# EAGLE board 26-de-8x (EAGLE 6.6.0), part 1 of 3
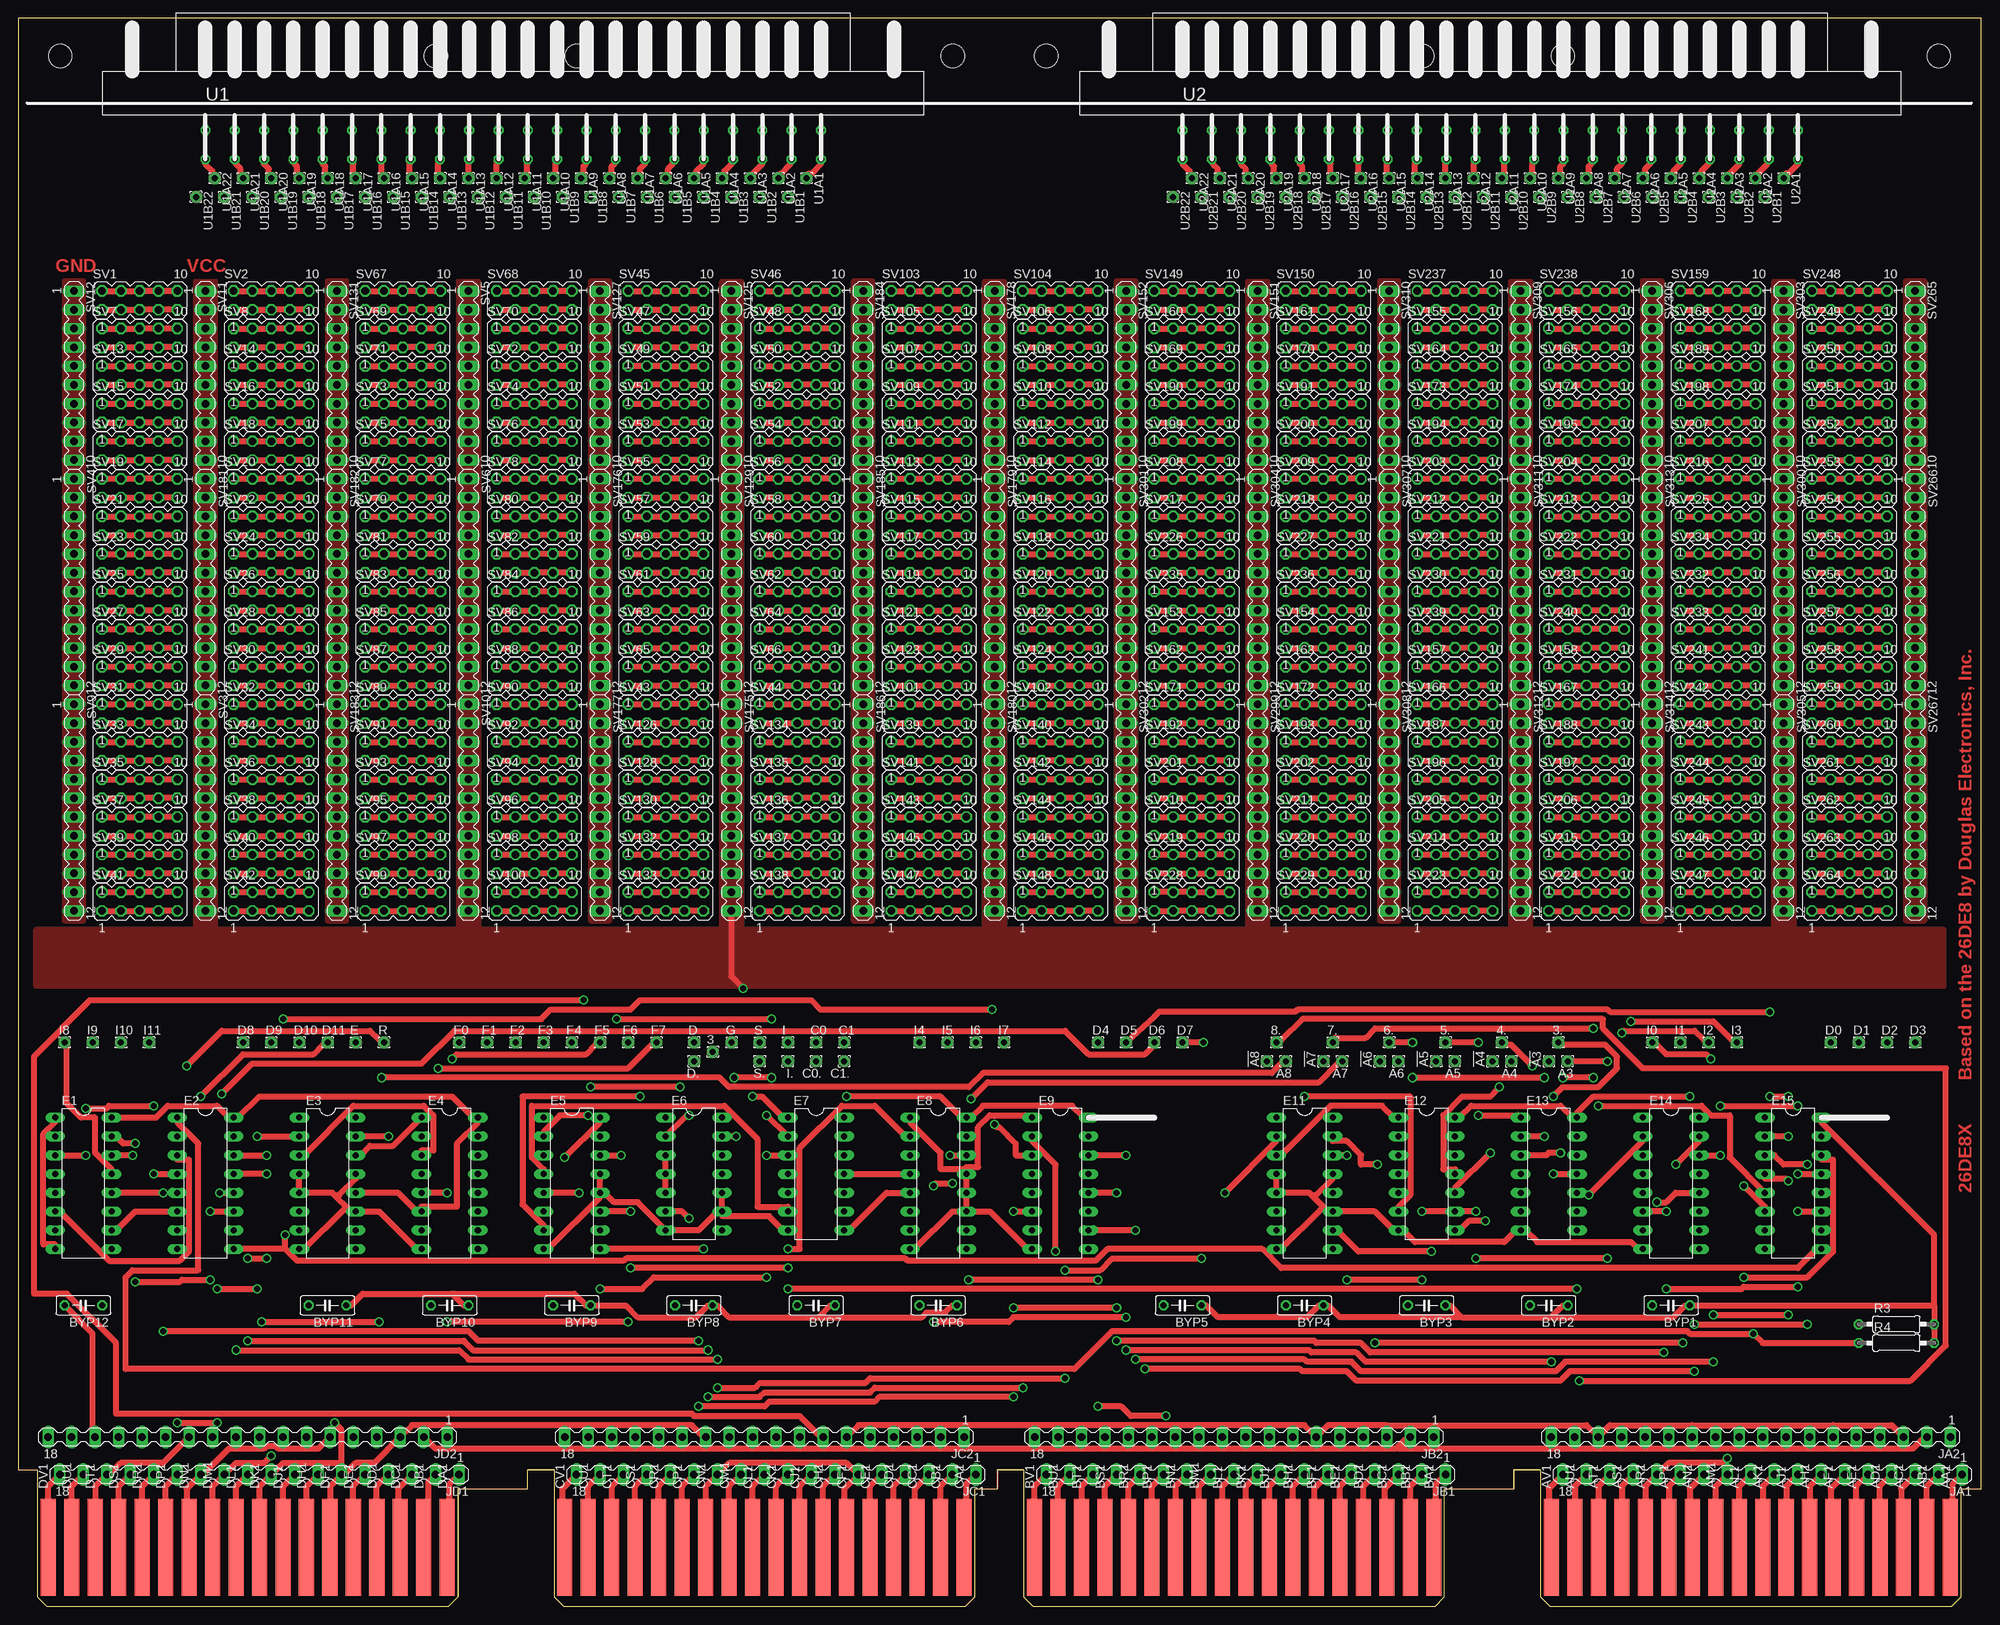
[diagram p4: board, top side]
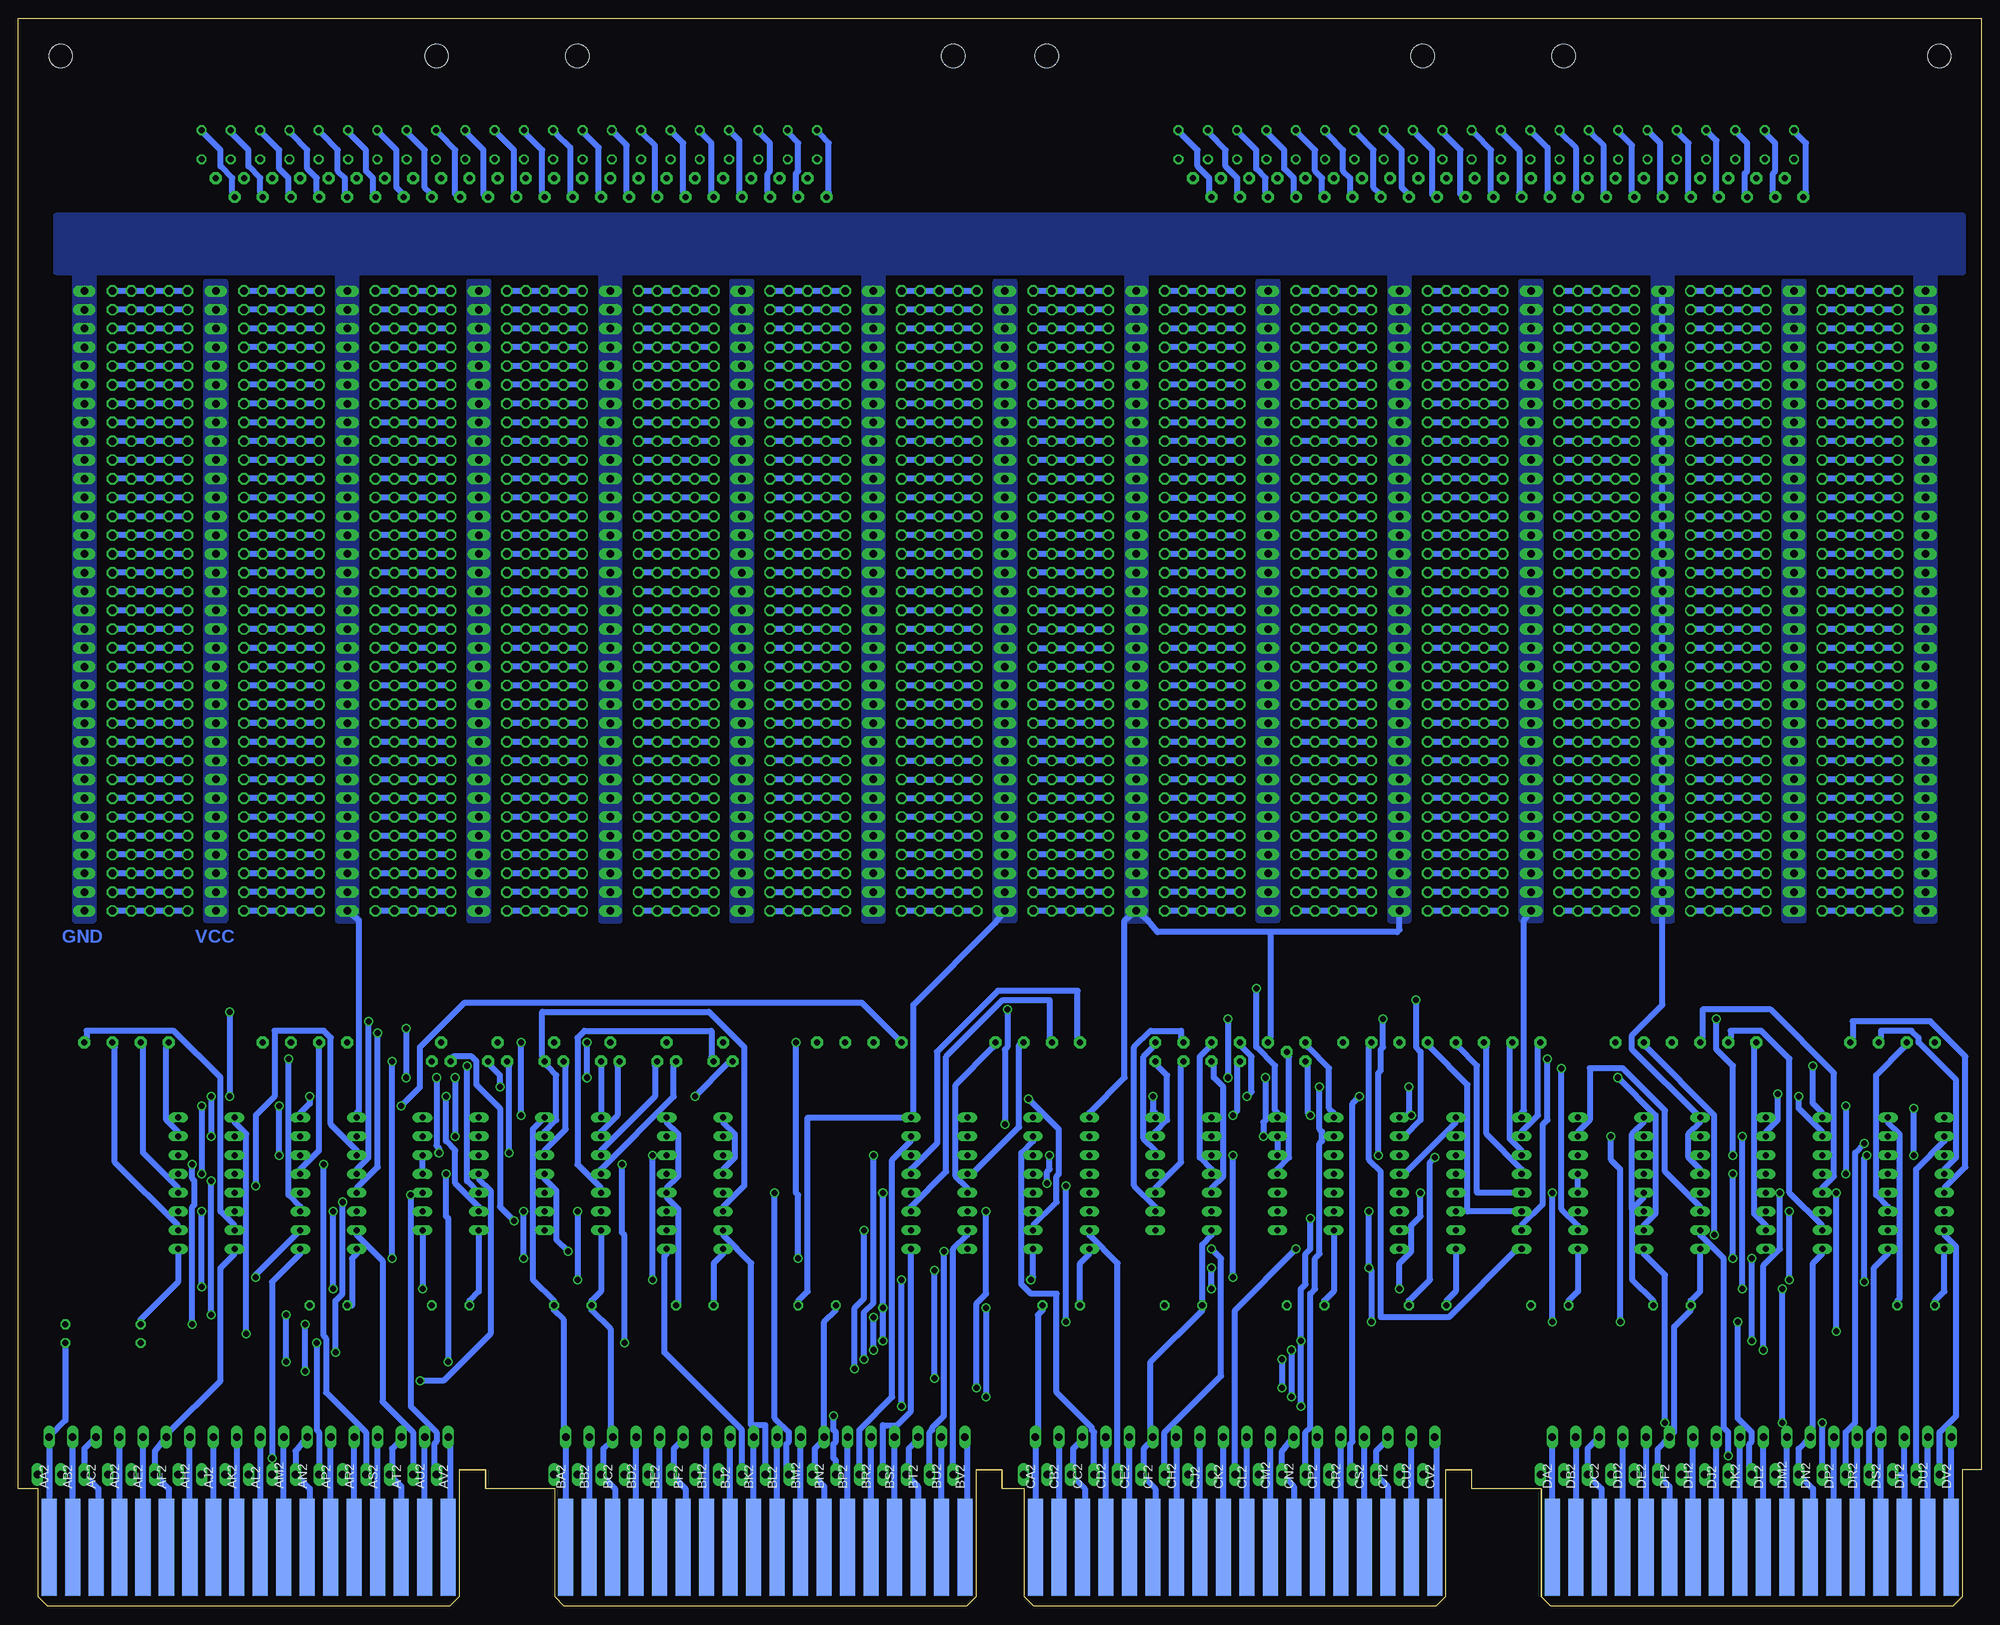
[diagram p5: board, bottom side, seen from below]

Size 265.3 x 214.63 mm. Coordinates in mm from the lower left corner, seen from the top.
Copper layers (1+16): Top 0.035mm / dielectric 1.5mm / Bottom 0.035mm
Design rules "16mils": minimum track width 16mil, minimum drill 32mil, track to track 15mil, track to pad 10mil, pad to pad 10mil, via to via 10mil, smd to smd 10mil, copper to edge 13mil, drill to drill 10mil, minimum pad ring 10mil, minimum via ring 8mil, stop-mask expansion 0mil, vias tented up to drill 0mil, thermal gap 10mil
Net classes: 0 default: width 0.813 mm; 1 supply: width 0.813 mm

## Footprints (pad centres in the part's own frame; a part is rotated, then mirrored left to right if it is on the bottom)
1,6/0,8 = drill 0.813 pad 1.6 octagon: 1 0,0
C050-025X075 = drill 0.813 octagon: 1 -2.54,0; 2 2.54,0
DIL16 = drill 0.813 long: 1 -8.89,-3.81; 2 -6.35,-3.81; 3 -3.81,-3.81; 4 -1.27,-3.81; 5 1.27,-3.81; 6 3.81,-3.81; 7 6.35,-3.81; 8 8.89,-3.81; 9 8.89,3.81; 10 6.35,3.81; 11 3.81,3.81; 12 1.27,3.81; 13 -1.27,3.81; 14 -3.81,3.81; 15 -6.35,3.81; 16 -8.89,3.81
DIL14 = drill 0.813 long: 1 -7.62,-3.81; 2 -5.08,-3.81; 3 -2.54,-3.81; 4 0,-3.81; 5 2.54,-3.81; 6 5.08,-3.81; 7 7.62,-3.81; 8 7.62,3.81; 9 5.08,3.81; 10 2.54,3.81; 11 0,3.81; 12 -2.54,3.81; 13 -5.08,3.81; 14 -7.62,3.81
MA18-1 = drill 1.016 long: 1 -25.4,0; 2 -22.225,0; 3 -19.05,0; 4 -15.875,0; 5 -12.7,0; 6 -9.525,0; 7 -6.35,0; 8 -3.175,0; 9 0,0; 10 3.175,0; 11 6.35,0; 12 9.525,0; 13 12.7,0; 14 15.875,0; 15 19.05,0; 16 22.225,0; 17 25.4,0; 18 28.575,0
0207/10 = drill 0.813 octagon: 1 -5.08,0; 2 5.08,0
MA05-2 = drill 1.016 octagon: 1 -5.08,-1.27; 2 -5.08,1.27; 3 -2.54,-1.27; 4 -2.54,1.27; 5 0,-1.27; 6 0,1.27; 7 2.54,-1.27; 8 2.54,1.27; 9 5.08,-1.27; 10 5.08,1.27
MA12-1 = drill 1.016 long: 1 -13.97,0; 2 -11.43,0; 3 -8.89,0; 4 -6.35,0; 5 -3.81,0; 6 -1.27,0; 7 1.27,0; 8 3.81,0; 9 6.35,0; 10 8.89,0; 11 11.43,0; 12 13.97,0
MA10-1 = drill 1.016 long: 1 -11.43,0; 2 -8.89,0; 3 -6.35,0; 4 -3.81,0; 5 -1.27,0; 6 1.27,0; 7 3.81,0; 8 6.35,0; 9 8.89,0; 10 11.43,0
133-022-03 = drill 0.813 octagon: A1 83.21,0; A2 83.21,3.962; B1 79.248,0; B2 79.248,3.962; C1 75.286,0; C2 75.286,3.962; D1 71.323,0; D2 71.323,3.962; E1 67.361,0; E2 67.361,3.962; F1 63.398,0; F2 63.398,3.962; H1 59.436,0; H2 59.436,3.962; J1 55.474,0; J2 55.474,3.962; K1 51.511,0; K2 51.511,3.962; L1 47.549,0; L2 47.549,3.962; M1 43.586,0; M2 43.586,3.962; N1 39.624,0; N2 39.624,3.962; P1 35.662,0; P2 35.662,3.962; R1 31.699,0; R2 31.699,3.962; S1 27.737,0; S2 27.737,3.962; T1 23.774,0; T2 23.774,3.962; U1 19.812,0; U2 19.812,3.962; V1 15.85,0; V2 15.85,3.962; W1 11.887,0; W2 11.887,3.962; X1 7.925,0; X2 7.925,3.962; Y1 3.962,0; Y2 3.962,3.962; Z1 0,0; Z2 0,3.962
OMNIBUS = hole 3.175: 208.915,209.55; 259.715,209.55; 189.865,209.55; 139.065,209.55; 75.616,209.55; 126.416,209.55; 56.566,209.55; 5.766,209.55
EDGE-CON8 = smd 2.032 x 13.106: AA1 261.303,7.938; AB1 258.127,7.938; AC1 254.952,7.938; AD1 251.778,7.938; AE1 248.602,7.938; AF1 245.428,7.938; AH1 242.252,7.938; AJ1 239.077,7.938; AK1 235.903,7.938; AL1 232.727,7.938; AM1 229.553,7.938; AN1 226.377,7.938; AP1 223.202,7.938; AR1 220.028,7.938; AS1 216.852,7.938; AT1 213.678,7.938; AU1 210.502,7.938; AV1 207.327,7.938; BA1 191.452,7.938; BB1 188.278,7.938; BC1 185.102,7.938; BD1 181.928,7.938; BE1 178.752,7.938; BF1 175.577,7.938; BH1 172.403,7.938; BJ1 169.227,7.938; BK1 166.053,7.938; BL1 162.877,7.938; BM1 159.702,7.938; BN1 156.528,7.938; BP1 153.352,7.938; BR1 150.178,7.938; BS1 147.002,7.938; BT1 143.827,7.938; BU1 140.653,7.938; BV1 137.477,7.938; CA1 127.953,7.938; CB1 124.778,7.938; CC1 121.603,7.938; CD1 118.427,7.938; CE1 115.252,7.938; CF1 112.078,7.938; CH1 108.903,7.938; CJ1 105.728,7.938; CK1 102.552,7.938; CL1 99.377,7.938; CM1 96.203,7.938; CN1 93.028,7.938; CP1 89.853,7.938; CR1 86.677,7.938; CS1 83.502,7.938; CT1 80.328,7.938; CU1 77.153,7.938; CV1 73.978,7.938; DA1 58.102,7.938; DB1 54.928,7.938; DC1 51.752,7.938; DD1 48.578,7.938; DE1 45.403,7.938; DF1 42.227,7.938; DH1 39.053,7.938; DJ1 35.877,7.938; DK1 32.703,7.938; DL1 29.527,7.938; DM1 26.352,7.938; DN1 23.177,7.938; DP1 20.003,7.938; DR1 16.828,7.938; DS1 13.652,7.938; DT1 10.477,7.938; DU1 7.303,7.938; DV1 4.128,7.938 | smd 2.032 x 13.106 bottom: AA2 261.303,7.938; AB2 258.127,7.938; AC2 254.952,7.938; AD2 251.778,7.938; AE2 248.602,7.938; AF2 245.428,7.938; AH2 242.252,7.938; AJ2 239.077,7.938; AK2 235.903,7.938; AL2 232.727,7.938; AM2 229.553,7.938; AN2 226.377,7.938; AP2 223.202,7.938; AR2 220.028,7.938; AS2 216.852,7.938; AT2 213.678,7.938; AU2 210.502,7.938; AV2 207.327,7.938; BA2 191.452,7.938; BB2 188.278,7.938; BC2 185.102,7.938; BD2 181.928,7.938; BE2 178.752,7.938; BF2 175.577,7.938; BH2 172.403,7.938; BJ2 169.227,7.938; BK2 166.053,7.938; BL2 162.877,7.938; BM2 159.702,7.938; BN2 156.528,7.938; BP2 153.352,7.938; BR2 150.178,7.938; BS2 147.002,7.938; BT2 143.827,7.938; BU2 140.653,7.938; BV2 137.477,7.938; CA2 127.953,7.938; CB2 124.778,7.938; CC2 121.603,7.938; CD2 118.427,7.938; CE2 115.252,7.938; CF2 112.078,7.938; CH2 108.903,7.938; CJ2 105.728,7.938; CK2 102.552,7.938; CL2 99.377,7.938; CM2 96.203,7.938; CN2 93.028,7.938; CP2 89.853,7.938; CR2 86.677,7.938; CS2 83.502,7.938; CT2 80.328,7.938; CU2 77.153,7.938; CV2 73.978,7.938; DA2 58.102,7.938; DB2 54.928,7.938; DC2 51.752,7.938; DD2 48.578,7.938; DE2 45.403,7.938; DF2 42.227,7.938; DH2 39.053,7.938; DJ2 35.877,7.938; DK2 32.703,7.938; DL2 29.527,7.938; DM2 26.352,7.938; DN2 23.177,7.938; DP2 20.003,7.938; DR2 16.828,7.938; DS2 13.652,7.938; DT2 10.477,7.938; DU2 7.303,7.938; DV2 4.128,7.938

## Placement (x,y rotation side)
3  [1,6/0,8]  93.85,74.93 0 top
3.  [1,6/0,8]  208.15,76.2 0 top
4.  [1,6/0,8]  200.53,76.2 0 top
5.  [1,6/0,8]  192.91,76.2 0 top
6.  [1,6/0,8]  185.29,76.2 0 top
7.  [1,6/0,8]  177.67,76.2 0 top
8.  [1,6/0,8]  170.05,76.2 0 top
!A3  [1,6/0,8]  206.88,73.66 90 top
!A4  [1,6/0,8]  199.26,73.66 90 top
!A5  [1,6/0,8]  191.64,73.66 90 top
!A6  [1,6/0,8]  184.02,73.66 90 top
!A7  [1,6/0,8]  176.4,73.66 90 top
!A8  [1,6/0,8]  168.78,73.66 90 top
A3  [1,6/0,8]  209.42,73.66 180 top
A4  [1,6/0,8]  201.8,73.66 180 top
A5  [1,6/0,8]  194.18,73.66 180 top
A6  [1,6/0,8]  186.56,73.66 180 top
A7  [1,6/0,8]  178.94,73.66 180 top
A8  [1,6/0,8]  171.32,73.66 180 top
BYP1  0.1uF  [C050-025X075]  223.39,40.64 180 top
BYP2  0.1uF  [C050-025X075]  206.88,40.64 180 top
BYP3  0.1uF  [C050-025X075]  190.37,40.64 180 top
BYP4  0.1uF  [C050-025X075]  173.86,40.64 180 top
BYP5  0.1uF  [C050-025X075]  157.35,40.64 180 top
BYP6  0.1uF  [C050-025X075]  124.33,40.64 180 top
BYP7  0.1uF  [C050-025X075]  107.82,40.64 180 top
BYP8  0.1uF  [C050-025X075]  91.31,40.64 180 top
BYP9  0.1uF  [C050-025X075]  74.8,40.64 180 top
BYP10  0.1uF  [C050-025X075]  58.29,40.64 180 top
BYP11  0.1uF  [C050-025X075]  41.78,40.64 180 top
BYP12  0.1uF  [C050-025X075]  8.76,40.64 180 top
C0  [1,6/0,8]  107.82,76.2 0 top
C0.  [1,6/0,8]  107.82,73.66 180 top
C1  [1,6/0,8]  111.63,76.2 0 top
C1.  [1,6/0,8]  111.63,73.66 180 top
D  [1,6/0,8]  91.31,76.2 0 top
D0  [1,6/0,8]  244.98,76.2 0 top
D1  [1,6/0,8]  248.79,76.2 0 top
D2  [1,6/0,8]  252.6,76.2 0 top
D3  [1,6/0,8]  256.41,76.2 0 top
D4  [1,6/0,8]  145.92,76.2 0 top
D5  [1,6/0,8]  149.73,76.2 0 top
D6  [1,6/0,8]  153.54,76.2 0 top
D7  [1,6/0,8]  157.35,76.2 0 top
D8  [1,6/0,8]  30.35,76.2 0 top
D9  [1,6/0,8]  34.16,76.2 0 top
D10  [1,6/0,8]  37.97,76.2 0 top
D11  [1,6/0,8]  41.78,76.2 0 top
D.  [1,6/0,8]  91.31,73.66 180 top
E  [1,6/0,8]  45.59,76.2 0 top
E1  AM26S10  [DIL16]  8.76,57.15 270 top
E2  74174N  [DIL16]  25.27,57.15 270 top
E3  AM26S10  [DIL16]  41.78,57.15 270 top
E4  74S138N  [DIL16]  58.29,57.15 270 top
E5  AM26S10  [DIL16]  74.8,57.15 270 top
E6  74LS00N  [DIL14]  91.31,58.42 270 top
E7  74LS08N  [DIL14]  107.82,58.42 270 top
E8  AM26S10  [DIL16]  124.33,57.15 270 top
E9  AM26S10  [DIL16]  140.84,57.15 270 top
E11  AM26S10  [DIL16]  173.86,57.15 270 top
E12  74LS04N  [DIL14]  190.37,58.42 270 top
E13  7430N  [DIL14]  206.88,58.42 270 top
E14  AM26S10  [DIL16]  223.39,57.15 270 top
E15  74174N  [DIL16]  239.9,57.15 270 top
F0  [1,6/0,8]  59.56,76.2 0 top
F1  [1,6/0,8]  63.37,76.2 0 top
F2  [1,6/0,8]  67.18,76.2 0 top
F3  [1,6/0,8]  70.99,76.2 0 top
F4  [1,6/0,8]  74.8,76.2 0 top
F5  [1,6/0,8]  78.61,76.2 0 top
F6  [1,6/0,8]  82.42,76.2 0 top
F7  [1,6/0,8]  86.23,76.2 0 top
G  [1,6/0,8]  96.39,76.2 0 top
I  [1,6/0,8]  104.01,76.2 0 top
I0  [1,6/0,8]  220.85,76.2 0 top
I1  [1,6/0,8]  224.66,76.2 0 top
I2  [1,6/0,8]  228.47,76.2 0 top
I3  [1,6/0,8]  232.28,76.2 0 top
I4  [1,6/0,8]  121.79,76.2 0 top
I5  [1,6/0,8]  125.6,76.2 0 top
I6  [1,6/0,8]  129.41,76.2 0 top
I7  [1,6/0,8]  133.22,76.2 0 top
I8  [1,6/0,8]  6.22,76.2 0 top
I9  [1,6/0,8]  10.03,76.2 0 top
I10  [1,6/0,8]  13.84,76.2 0 top
I11  [1,6/0,8]  17.65,76.2 0 top
I.  [1,6/0,8]  104.01,73.66 180 top
JA1  MA18-1  [MA18-1]  237.36,17.78 180 top
JA2  MA18-1  [MA18-1]  235.78,22.86 180 top
JB1  MA18-1  [MA18-1]  167.51,17.78 180 top
JB2  MA18-1  [MA18-1]  165.93,22.86 180 top
JC1  MA18-1  [MA18-1]  104.01,17.78 180 top
JC2  MA18-1  [MA18-1]  102.43,22.86 180 top
JD1  MA18-1  [MA18-1]  34.16,17.78 180 top
JD2  MA18-1  [MA18-1]  32.58,22.86 180 top
R  [1,6/0,8]  49.4,76.2 0 top
R3  [0207/10]  253.87,38.1 0 top
R4  [0207/10]  253.87,35.56 0 top
S  [1,6/0,8]  100.2,76.2 0 top
S.  [1,6/0,8]  100.2,73.66 180 top
SV1  [MA05-2]  16.38,176.53 0 top
SV2  [MA05-2]  34.16,176.53 0 top
SV3  [MA12-1]  25.27,107.95 270 top
SV4  [MA12-1]  7.49,138.43 270 top
SV5  [MA10-1]  60.83,166.37 270 top
SV6  [MA12-1]  60.83,138.43 270 top
SV7  [MA05-2]  16.38,171.45 0 top
SV8  [MA05-2]  34.16,171.45 0 top
SV9  [MA12-1]  7.49,107.95 270 top
SV10  [MA12-1]  60.83,107.95 270 top
SV11  [MA10-1]  25.27,166.37 270 top
SV12  [MA10-1]  7.49,166.37 270 top
SV13  [MA05-2]  16.38,166.37 0 top
SV14  [MA05-2]  34.16,166.37 0 top
SV15  [MA05-2]  16.38,161.29 0 top
SV16  [MA05-2]  34.16,161.29 0 top
SV17  [MA05-2]  16.38,156.21 0 top
SV18  [MA05-2]  34.16,156.21 0 top
SV19  [MA05-2]  16.38,151.13 0 top
SV20  [MA05-2]  34.16,151.13 0 top
SV21  [MA05-2]  16.38,146.05 0 top
SV22  [MA05-2]  34.16,146.05 0 top
SV23  [MA05-2]  16.38,140.97 0 top
SV24  [MA05-2]  34.16,140.97 0 top
SV25  [MA05-2]  16.38,135.89 0 top
SV26  [MA05-2]  34.16,135.89 0 top
SV27  [MA05-2]  16.38,130.81 0 top
SV28  [MA05-2]  34.16,130.81 0 top
SV29  [MA05-2]  16.38,125.73 0 top
SV30  [MA05-2]  34.16,125.73 0 top
SV31  [MA05-2]  16.38,120.65 0 top
SV32  [MA05-2]  34.16,120.65 0 top
SV33  [MA05-2]  16.38,115.57 0 top
SV34  [MA05-2]  34.16,115.57 0 top
SV35  [MA05-2]  16.38,110.49 0 top
SV36  [MA05-2]  34.16,110.49 0 top
SV37  [MA05-2]  16.38,105.41 0 top
SV38  [MA05-2]  34.16,105.41 0 top
SV39  [MA05-2]  16.38,100.33 0 top
SV40  [MA05-2]  34.16,100.33 0 top
SV41  [MA05-2]  16.38,95.25 0 top
SV42  [MA05-2]  34.16,95.25 0 top
SV43  [MA05-2]  87.5,120.65 0 top
SV44  [MA05-2]  105.28,120.65 0 top
SV45  [MA05-2]  87.5,176.53 0 top
SV46  [MA05-2]  105.28,176.53 0 top
SV47  [MA05-2]  87.5,171.45 0 top
SV48  [MA05-2]  105.28,171.45 0 top
SV49  [MA05-2]  87.5,166.37 0 top
SV50  [MA05-2]  105.28,166.37 0 top
SV51  [MA05-2]  87.5,161.29 0 top
SV52  [MA05-2]  105.28,161.29 0 top
SV53  [MA05-2]  87.5,156.21 0 top
SV54  [MA05-2]  105.28,156.21 0 top
SV55  [MA05-2]  87.5,151.13 0 top
SV56  [MA05-2]  105.28,151.13 0 top
SV57  [MA05-2]  87.5,146.05 0 top
SV58  [MA05-2]  105.28,146.05 0 top
SV59  [MA05-2]  87.5,140.97 0 top
SV60  [MA05-2]  105.28,140.97 0 top
SV61  [MA05-2]  87.5,135.89 0 top
SV62  [MA05-2]  105.28,135.89 0 top
SV63  [MA05-2]  87.5,130.81 0 top
SV64  [MA05-2]  105.28,130.81 0 top
SV65  [MA05-2]  87.5,125.73 0 top
SV66  [MA05-2]  105.28,125.73 0 top
SV67  [MA05-2]  51.94,176.53 0 top
SV68  [MA05-2]  69.72,176.53 0 top
SV69  [MA05-2]  51.94,171.45 0 top
SV70  [MA05-2]  69.72,171.45 0 top
SV71  [MA05-2]  51.94,166.37 0 top
SV72  [MA05-2]  69.72,166.37 0 top
SV73  [MA05-2]  51.94,161.29 0 top
SV74  [MA05-2]  69.72,161.29 0 top
SV75  [MA05-2]  51.94,156.21 0 top
SV76  [MA05-2]  69.72,156.21 0 top
SV77  [MA05-2]  51.94,151.13 0 top
SV78  [MA05-2]  69.72,151.13 0 top
SV79  [MA05-2]  51.94,146.05 0 top
SV80  [MA05-2]  69.72,146.05 0 top
SV81  [MA05-2]  51.94,140.97 0 top
SV82  [MA05-2]  69.72,140.97 0 top
SV83  [MA05-2]  51.94,135.89 0 top
SV84  [MA05-2]  69.72,135.89 0 top
SV85  [MA05-2]  51.94,130.81 0 top
SV86  [MA05-2]  69.72,130.81 0 top
SV87  [MA05-2]  51.94,125.73 0 top
SV88  [MA05-2]  69.72,125.73 0 top
SV89  [MA05-2]  51.94,120.65 0 top
SV90  [MA05-2]  69.72,120.65 0 top
SV91  [MA05-2]  51.94,115.57 0 top
SV92  [MA05-2]  69.72,115.57 0 top
SV93  [MA05-2]  51.94,110.49 0 top
SV94  [MA05-2]  69.72,110.49 0 top
SV95  [MA05-2]  51.94,105.41 0 top
SV96  [MA05-2]  69.72,105.41 0 top
SV97  [MA05-2]  51.94,100.33 0 top
SV98  [MA05-2]  69.72,100.33 0 top
SV99  [MA05-2]  51.94,95.25 0 top
SV100  [MA05-2]  69.72,95.25 0 top
SV101  [MA05-2]  123.06,120.65 0 top
SV102  [MA05-2]  140.84,120.65 0 top
SV103  [MA05-2]  123.06,176.53 0 top
SV104  [MA05-2]  140.84,176.53 0 top
SV105  [MA05-2]  123.06,171.45 0 top
SV106  [MA05-2]  140.84,171.45 0 top
SV107  [MA05-2]  123.06,166.37 0 top
SV108  [MA05-2]  140.84,166.37 0 top
SV109  [MA05-2]  123.06,161.29 0 top
SV110  [MA05-2]  140.84,161.29 0 top
SV111  [MA05-2]  123.06,156.21 0 top
SV112  [MA05-2]  140.84,156.21 0 top
SV113  [MA05-2]  123.06,151.13 0 top
SV114  [MA05-2]  140.84,151.13 0 top
SV115  [MA05-2]  123.06,146.05 0 top
SV116  [MA05-2]  140.84,146.05 0 top
SV117  [MA05-2]  123.06,140.97 0 top
SV118  [MA05-2]  140.84,140.97 0 top
SV119  [MA05-2]  123.06,135.89 0 top
SV120  [MA05-2]  140.84,135.89 0 top
SV121  [MA05-2]  123.06,130.81 0 top
SV122  [MA05-2]  140.84,130.81 0 top
SV123  [MA05-2]  123.06,125.73 0 top
SV124  [MA05-2]  140.84,125.73 0 top
SV125  [MA10-1]  96.39,166.37 270 top
SV126  [MA05-2]  87.5,115.57 0 top
SV127  [MA10-1]  78.61,166.37 270 top
SV128  [MA05-2]  87.5,110.49 0 top
SV129  [MA12-1]  96.39,138.43 270 top
SV130  [MA05-2]  87.5,105.41 0 top
SV131  [MA10-1]  43.05,166.37 270 top
SV132  [MA05-2]  87.5,100.33 0 top
SV133  [MA05-2]  87.5,95.25 0 top
SV134  [MA05-2]  105.28,115.57 0 top
SV135  [MA05-2]  105.28,110.49 0 top
SV136  [MA05-2]  105.28,105.41 0 top
SV137  [MA05-2]  105.28,100.33 0 top
SV138  [MA05-2]  105.28,95.25 0 top
SV139  [MA05-2]  123.06,115.57 0 top
SV140  [MA05-2]  140.84,115.57 0 top
SV141  [MA05-2]  123.06,110.49 0 top
SV142  [MA05-2]  140.84,110.49 0 top
SV143  [MA05-2]  123.06,105.41 0 top
SV144  [MA05-2]  140.84,105.41 0 top
SV145  [MA05-2]  123.06,100.33 0 top
SV146  [MA05-2]  140.84,100.33 0 top
SV147  [MA05-2]  123.06,95.25 0 top
SV148  [MA05-2]  140.84,95.25 0 top
SV149  [MA05-2]  158.62,176.53 0 top
SV150  [MA05-2]  176.4,176.53 0 top
SV151  [MA10-1]  167.51,166.37 270 top
SV152  [MA10-1]  149.73,166.37 270 top
SV153  [MA05-2]  158.62,130.81 0 top
SV154  [MA05-2]  176.4,130.81 0 top
SV155  [MA05-2]  194.18,171.45 0 top
SV156  [MA05-2]  211.96,171.45 0 top
SV157  [MA05-2]  194.18,125.73 0 top
SV158  [MA05-2]  211.96,125.73 0 top
SV159  [MA05-2]  229.74,176.53 0 top
SV160  [MA05-2]  158.62,171.45 0 top
SV161  [MA05-2]  176.4,171.45 0 top
SV162  [MA05-2]  158.62,125.73 0 top
SV163  [MA05-2]  176.4,125.73 0 top
SV164  [MA05-2]  194.18,166.37 0 top
SV165  [MA05-2]  211.96,166.37 0 top
SV166  [MA05-2]  194.18,120.65 0 top
SV167  [MA05-2]  211.96,120.65 0 top
SV168  [MA05-2]  229.74,171.45 0 top
SV169  [MA05-2]  158.62,166.37 0 top
SV170  [MA05-2]  176.4,166.37 0 top
SV171  [MA05-2]  158.62,120.65 0 top
SV172  [MA05-2]  176.4,120.65 0 top
SV173  [MA05-2]  194.18,161.29 0 top
SV174  [MA05-2]  211.96,161.29 0 top
SV175  [MA12-1]  96.39,107.95 270 top
SV176  [MA12-1]  78.61,138.43 270 top
SV177  [MA12-1]  78.61,107.95 270 top
SV178  [MA10-1]  131.95,166.37 270 top
SV179  [MA12-1]  131.95,138.43 270 top
SV180  [MA12-1]  131.95,107.95 270 top
SV181  [MA12-1]  25.27,138.43 270 top
SV182  [MA12-1]  43.05,138.43 270 top
SV183  [MA12-1]  43.05,107.95 270 top
SV184  [MA10-1]  114.17,166.37 270 top
SV185  [MA12-1]  114.17,138.43 270 top
SV186  [MA12-1]  114.17,107.95 270 top
SV187  [MA05-2]  194.18,115.57 0 top
SV188  [MA05-2]  211.96,115.57 0 top
SV189  [MA05-2]  229.74,166.37 0 top
SV190  [MA05-2]  158.62,161.29 0 top
SV191  [MA05-2]  176.4,161.29 0 top
SV192  [MA05-2]  158.62,115.57 0 top
SV193  [MA05-2]  176.4,115.57 0 top
SV194  [MA05-2]  194.18,156.21 0 top
SV195  [MA05-2]  211.96,156.21 0 top
SV196  [MA05-2]  194.18,110.49 0 top
SV197  [MA05-2]  211.96,110.49 0 top
SV198  [MA05-2]  229.74,161.29 0 top
SV199  [MA05-2]  158.62,156.21 0 top
SV200  [MA05-2]  176.4,156.21 0 top
SV201  [MA05-2]  158.62,110.49 0 top
SV202  [MA05-2]  176.4,110.49 0 top
SV203  [MA05-2]  194.18,151.13 0 top
SV204  [MA05-2]  211.96,151.13 0 top
SV205  [MA05-2]  194.18,105.41 0 top
SV206  [MA05-2]  211.96,105.41 0 top
SV207  [MA05-2]  229.74,156.21 0 top
SV208  [MA05-2]  158.62,151.13 0 top
SV209  [MA05-2]  176.4,151.13 0 top
SV210  [MA05-2]  158.62,105.41 0 top
SV211  [MA05-2]  176.4,105.41 0 top
SV212  [MA05-2]  194.18,146.05 0 top
SV213  [MA05-2]  211.96,146.05 0 top
SV214  [MA05-2]  194.18,100.33 0 top
SV215  [MA05-2]  211.96,100.33 0 top
SV216  [MA05-2]  229.74,151.13 0 top
SV217  [MA05-2]  158.62,146.05 0 top
SV218  [MA05-2]  176.4,146.05 0 top
SV219  [MA05-2]  158.62,100.33 0 top
SV220  [MA05-2]  176.4,100.33 0 top
SV221  [MA05-2]  194.18,140.97 0 top
SV222  [MA05-2]  211.96,140.97 0 top
SV223  [MA05-2]  194.18,95.25 0 top
SV224  [MA05-2]  211.96,95.25 0 top
SV225  [MA05-2]  229.74,146.05 0 top
SV226  [MA05-2]  158.62,140.97 0 top
SV227  [MA05-2]  176.4,140.97 0 top
SV228  [MA05-2]  158.62,95.25 0 top
SV229  [MA05-2]  176.4,95.25 0 top
SV230  [MA05-2]  194.18,135.89 0 top
SV231  [MA05-2]  211.96,135.89 0 top
SV232  [MA05-2]  229.74,135.89 0 top
SV233  [MA05-2]  229.74,130.81 0 top
SV234  [MA05-2]  229.74,140.97 0 top
SV235  [MA05-2]  158.62,135.89 0 top
SV236  [MA05-2]  176.4,135.89 0 top
SV237  [MA05-2]  194.18,176.53 0 top
SV238  [MA05-2]  211.96,176.53 0 top
SV239  [MA05-2]  194.18,130.81 0 top
SV240  [MA05-2]  211.96,130.81 0 top
SV241  [MA05-2]  229.74,125.73 0 top
SV242  [MA05-2]  229.74,120.65 0 top
SV243  [MA05-2]  229.74,115.57 0 top
SV244  [MA05-2]  229.74,110.49 0 top
SV245  [MA05-2]  229.74,105.41 0 top
SV246  [MA05-2]  229.74,100.33 0 top
SV247  [MA05-2]  229.74,95.25 0 top
SV248  [MA05-2]  247.52,176.53 0 top
SV249  [MA05-2]  247.52,171.45 0 top
SV250  [MA05-2]  247.52,166.37 0 top
SV251  [MA05-2]  247.52,161.29 0 top
SV252  [MA05-2]  247.52,156.21 0 top
SV253  [MA05-2]  247.52,151.13 0 top
SV254  [MA05-2]  247.52,146.05 0 top
SV255  [MA05-2]  247.52,140.97 0 top
SV256  [MA05-2]  247.52,135.89 0 top
SV257  [MA05-2]  247.52,130.81 0 top
SV258  [MA05-2]  247.52,125.73 0 top
SV259  [MA05-2]  247.52,120.65 0 top
SV260  [MA05-2]  247.52,115.57 0 top
SV261  [MA05-2]  247.52,110.49 0 top
SV262  [MA05-2]  247.52,105.41 0 top
SV263  [MA05-2]  247.52,100.33 0 top
SV264  [MA05-2]  247.52,95.25 0 top
SV265  [MA10-1]  256.41,166.37 270 top
SV266  [MA12-1]  256.41,138.43 270 top
SV267  [MA12-1]  256.41,107.95 270 top
SV299  [MA12-1]  167.51,107.95 270 top
SV300  [MA12-1]  238.63,138.43 270 top
SV301  [MA12-1]  149.73,138.43 270 top
SV302  [MA12-1]  149.73,107.95 270 top
SV303  [MA10-1]  238.63,166.37 270 top
SV304  [MA12-1]  167.51,138.43 270 top
SV305  [MA12-1]  238.63,107.95 270 top
SV306  [MA10-1]  220.85,166.37 270 top
SV307  [MA12-1]  185.29,138.43 270 top
SV308  [MA12-1]  185.29,107.95 270 top
SV309  [MA10-1]  203.07,166.37 270 top
SV310  [MA10-1]  185.29,166.37 270 top
SV311  [MA12-1]  203.07,138.43 270 top
SV312  [MA12-1]  203.07,107.95 270 top
SV313  [MA12-1]  220.85,138.43 270 top
SV314  [MA12-1]  220.85,107.95 270 top
U1  133-022-03  [133-022-03]  25.27,195.58 0 top
U1A1  [1,6/0,8]  106.55,193.04 270 top
U1A2  [1,6/0,8]  102.74,193.04 270 top
U1A3  [1,6/0,8]  98.93,193.04 270 top
U1A4  [1,6/0,8]  95.12,193.04 270 top
U1A5  [1,6/0,8]  91.31,193.04 270 top
U1A6  [1,6/0,8]  87.5,193.04 270 top
U1A7  [1,6/0,8]  83.69,193.04 270 top
U1A8  [1,6/0,8]  79.88,193.04 270 top
U1A9  [1,6/0,8]  76.07,193.04 270 top
U1A10  [1,6/0,8]  72.26,193.04 270 top
U1A11  [1,6/0,8]  68.45,193.04 270 top
U1A12  [1,6/0,8]  64.64,193.04 270 top
U1A13  [1,6/0,8]  60.83,193.04 270 top
U1A14  [1,6/0,8]  57.02,193.04 270 top
U1A15  [1,6/0,8]  53.21,193.04 270 top
U1A16  [1,6/0,8]  49.4,193.04 270 top
U1A17  [1,6/0,8]  45.59,193.04 270 top
U1A18  [1,6/0,8]  41.78,193.04 270 top
U1A19  [1,6/0,8]  37.97,193.04 270 top
U1A20  [1,6/0,8]  34.16,193.04 270 top
U1A21  [1,6/0,8]  30.35,193.04 270 top
U1A22  [1,6/0,8]  26.54,193.04 270 top
U1B1  [1,6/0,8]  104.01,190.5 270 top
U1B2  [1,6/0,8]  100.2,190.5 270 top
U1B3  [1,6/0,8]  96.39,190.5 270 top
U1B4  [1,6/0,8]  92.58,190.5 270 top
U1B5  [1,6/0,8]  88.77,190.5 270 top
U1B6  [1,6/0,8]  84.96,190.5 270 top
U1B7  [1,6/0,8]  81.15,190.5 270 top
U1B8  [1,6/0,8]  77.34,190.5 270 top
U1B9  [1,6/0,8]  73.53,190.5 270 top
U1B10  [1,6/0,8]  69.72,190.5 270 top
U1B11  [1,6/0,8]  65.91,190.5 270 top
U1B12  [1,6/0,8]  62.1,190.5 270 top
U1B13  [1,6/0,8]  58.29,190.5 270 top
U1B14  [1,6/0,8]  54.48,190.5 270 top
U1B15  [1,6/0,8]  50.67,190.5 270 top
U1B16  [1,6/0,8]  46.86,190.5 270 top
U1B17  [1,6/0,8]  43.05,190.5 270 top
U1B18  [1,6/0,8]  39.24,190.5 270 top
U1B19  [1,6/0,8]  35.43,190.5 270 top
U1B20  [1,6/0,8]  31.62,190.5 270 top
U1B21  [1,6/0,8]  27.81,190.5 270 top
U1B22  [1,6/0,8]  24,190.5 270 top
U2  133-022-03  [133-022-03]  157.35,195.58 0 top
U2A1  [1,6/0,8]  238.63,193.04 270 top
U2A2  [1,6/0,8]  234.82,193.04 270 top
U2A3  [1,6/0,8]  231.01,193.04 270 top
U2A4  [1,6/0,8]  227.2,193.04 270 top
U2A5  [1,6/0,8]  223.39,193.04 270 top
U2A6  [1,6/0,8]  219.58,193.04 270 top
U2A7  [1,6/0,8]  215.77,193.04 270 top
U2A8  [1,6/0,8]  211.96,193.04 270 top
U2A9  [1,6/0,8]  208.15,193.04 270 top
U2A10  [1,6/0,8]  204.34,193.04 270 top
U2A11  [1,6/0,8]  200.53,193.04 270 top
U2A12  [1,6/0,8]  196.72,193.04 270 top
U2A13  [1,6/0,8]  192.91,193.04 270 top
U2A14  [1,6/0,8]  189.1,193.04 270 top
U2A15  [1,6/0,8]  185.29,193.04 270 top
U2A16  [1,6/0,8]  181.48,193.04 270 top
U2A17  [1,6/0,8]  177.67,193.04 270 top
U2A18  [1,6/0,8]  173.86,193.04 270 top
U2A19  [1,6/0,8]  170.05,193.04 270 top
U2A20  [1,6/0,8]  166.24,193.04 270 top
U2A21  [1,6/0,8]  162.43,193.04 270 top
U2A22  [1,6/0,8]  158.62,193.04 270 top
U2B1  [1,6/0,8]  236.09,190.5 270 top
U2B2  [1,6/0,8]  232.28,190.5 270 top
U2B3  [1,6/0,8]  228.47,190.5 270 top
U2B4  [1,6/0,8]  224.66,190.5 270 top
U2B5  [1,6/0,8]  220.85,190.5 270 top
U2B6  [1,6/0,8]  217.04,190.5 270 top
U2B7  [1,6/0,8]  213.23,190.5 270 top
U2B8  [1,6/0,8]  209.42,190.5 270 top
U2B9  [1,6/0,8]  205.61,190.5 270 top
U2B10  [1,6/0,8]  201.8,190.5 270 top
U2B11  [1,6/0,8]  197.99,190.5 270 top
U2B12  [1,6/0,8]  194.18,190.5 270 top
U2B13  [1,6/0,8]  190.37,190.5 270 top
U2B14  [1,6/0,8]  186.56,190.5 270 top
U2B15  [1,6/0,8]  182.75,190.5 270 top
U2B16  [1,6/0,8]  178.94,190.5 270 top
U2B17  [1,6/0,8]  175.13,190.5 270 top
U2B18  [1,6/0,8]  171.32,190.5 270 top
U2B19  [1,6/0,8]  167.51,190.5 270 top
U2B20  [1,6/0,8]  163.7,190.5 270 top
U2B21  [1,6/0,8]  159.89,190.5 270 top
U2B22  [1,6/0,8]  156.08,190.5 270 top
U$1  OUTLINE-OMNIBUS  [OMNIBUS]  -0.13,0 0 top
U$2  [EDGE-CON8]  -0.13,0 0 top

## Tracks (layer width: path | path; a pad name or v marks a point on that pad's centre or on a via)
!BREAK_CYCLE
  Bottom 0.813: JB2.10 162.75,13.97 U$2.BL2
!BRK_DATA_CONT
  Bottom 0.813: JB2.9 165.93,13.97 U$2.BK2
!BRK_IN_PROG
  Bottom 0.813: JB2.5 178.62,13.97 U$2.BE2
!BUS_STROBE
  Top 0.813: JC1.9 102.43,16.19 U$2.CK1
!C0
  Top 0.813: U$2.CE1 115.12,16.19 JC1.5
  Bottom 0.813: E8.7 120.52,50.16 116.71,46.35 JC1.5
!C1  (via drill 0.81)
  Top 0.813: JC1.7 108.78,16.19 U$2.CH1 | v104.01,48.26 105.6,48.26 105.6,61.91 111.31,67.63 115.76,67.63 119.89,63.5 E8.2
  Bottom 0.813: v104.01,48.26 102.74,46.99 102.74,31.11 110.36,23.5 JC1.7
!C2
  Top 0.813: JC1.8 105.6,16.19 U$2.CJ1
!CPMA_DISABLE
  Top 0.813: JC1.17 77.03,16.19 U$2.CU1
!D
  Bottom 0.813: JD2.9 32.58,13.97 U$2.DK2
!DATA0  (via drill 0.81)
  Top 0.813: U$2.AR1 219.9,16.19 JA1.14 223.07,19.37 230.38,19.37 v231.01,20
  Bottom 0.813: v231.01,20 231.01,43.81 227.2,47.62 E14.9
!DATA1  (via drill 0.81)
  Top 0.813: U$2.AS1 216.72,16.19 JA1.15 | v224.03,59.69 227.2,62.87 E14.15
  Bottom 0.813: v224.03,59.69 224.03,36.51 223.71,36.2 223.71,28.89 218.31,23.5 JA1.15
!DATA2
  Top 0.813: U$2.AU1 210.38,16.19 JA1.17
  Bottom 0.813: E14.7 219.58,50.16 216.09,46.67 216.09,27.62 211.96,23.5 JA1.17
!DATA3  (via drill 0.81)
  Top 0.813: U$2.AV1 206.88,13.97 206.88,15.88 JA1.18 | v212.28,55.56 219.58,62.87 E14.2
  Bottom 0.813: JA1.18 209.1,18.41 209.1,21.91 208.79,22.23 208.79,23.5 212.28,26.99 v212.28,55.56
!DATA4
  Top 0.813: U$2.BR1 150.05,16.19 JB1.14
  Bottom 0.813: E9.15 144.65,62.87 147.19,60.33 147.19,28.26 151.64,23.81 JB1.14
!DATA5
  Top 0.813: U$2.BS1 146.88,16.19 JB1.15
  Bottom 0.813: E9.9 144.65,26.35 146.56,24.45 148.46,24.45 JB1.15
!DATA6  (via drill 0.81)
  Top 0.813: U$2.BU1 140.53,16.19 JB1.17 | v140.21,47.94 140.21,59.69 137.03,62.87 E9.2
  Bottom 0.813: JB1.17 142.11,23.5 141.8,23.81 141.8,24.13 140.21,25.72 v140.21,47.94
!DATA7
  Top 0.813: U$2.BV1 137.35,16.19 JB1.18
  Bottom 0.813: E9.7 137.03,50.16 138.94,48.26 JB1.18
!DATA8  (via drill 0.81)
  Top 0.813: U$2.DR1 16.7,16.19 JD1.14 | v15.75,62.55 14.16,62.55 13.21,63.5 E1.15
  Bottom 0.813: v15.75,62.55 17.02,61.28 17.02,24.77 18.29,23.5 JD1.14
!DATA9
  Top 0.813: U$2.DS1 13.52,16.19 JD1.15
  Bottom 0.813: E1.9 12.57,47.62 14.48,45.72 14.48,24.13 15.11,23.5 JD1.15
!DATA10
  Top 0.813: U$2.DU1 7.18,8.02 7.18,16.19 JD1.17
  Bottom 0.813: E1.2 4.95,62.87 8.76,59.05 JD1.17
!DATA11
  Top 0.813: U$2.DV1 4,8.06 4,16.19 JD1.18
  Bottom 0.813: E1.7 4.95,50.16 3.37,48.58 3.37,25.72 5.59,23.5 JD1.18
!E
  Bottom 0.813: JD2.10 29.4,13.97 U$2.DL2
!EMA0
  Bottom 0.813: JA2.4 251.65,13.97 U$2.AD2
!EMA1
  Bottom 0.813: JA2.5 248.47,13.97 U$2.AE2
!EMA2
  Bottom 0.813: JA2.7 242.12,13.97 U$2.AH2
!F
  Bottom 0.813: JD2.8 35.75,13.97 U$2.DJ2
!FSET
  Bottom 0.813: JD2.13 19.88,13.97 U$2.DP2
!IND1
  Bottom 0.813: JC2.17 77.03,13.97 U$2.CU2
!IND2
  Bottom 0.813: JC2.18 73.53,22.23 73.53,13.97 U$2.CV2
!INT_RQST  (via drill 0.81)
  Top 0.813: U$2.CP1 89.73,16.19 JC1.13 | v77.03,66.36 73.22,66.36 70.99,64.14 E5.2 | v89.41,70.17 v77.34,70.17
  Bottom 0.813: v77.03,66.36 77.34,66.67 v77.34,70.17 | v89.41,70.17 89.41,64.45 89.09,64.14 89.09,62.87 89.41,62.55 89.41,47.62 90.04,46.99 90.04,42.86 90.68,42.23 90.68,24.13 91.31,23.5 JC1.13
!INTERNAL_IO  (via drill 0.81)
  Top 0.813: U$2.CL1 99.25,16.19 JC1.10 | v92.58,48.26 E5.9
  Bottom 0.813: v92.58,48.26 100.84,40.01 JC1.10
!IO_PAUSE
  Top 0.813: JC1.4 118.3,16.19 U$2.CD1
  Bottom 0.813: JC1.4 119.89,23.5 120.2,23.81 120.2,24.13 124.97,28.89 124.97,42.23 128.46,42.23 129.73,43.5 129.73,61.28 128.14,62.87 E8.15
!IR0
  Bottom 0.813: JD2.4 48.45,13.97 U$2.DD2
!IR1
  Bottom 0.813: JD2.5 45.28,13.97 U$2.DE2
!IR2
  Bottom 0.813: JD2.7 38.93,13.97 U$2.DH2
!KEY_CONT
  Bottom 0.813: U$2.DU2 7.18,7.73 JD2.17
!LA_ENABLE
  Bottom 0.813: JB2.11 159.57,13.97 U$2.BM2
!LINK
  Bottom 0.813: JA2.18 206.88,22.23 206.88,13.97 U$2.AV2
!LINK_DATA
  Bottom 0.813: JC2.14 86.55,13.97 U$2.CR2
!LINK_LOAD
  Bottom 0.813: JC2.15 83.38,13.97 U$2.CS2
!LOAD_CONT
  Bottom 0.813: JB2.7 172.28,13.97 U$2.BH2
!MA00
  Top 0.813: JA1.4 251.65,16.19 U$2.AD1
!MA01
  Top 0.813: JA1.5 248.47,16.19 U$2.AE1
!MA02
  Top 0.813: JA1.7 242.12,16.19 U$2.AH1
!MA03
  Top 0.813: JA1.8 238.95,16.19 U$2.AJ1
!MA04
  Top 0.813: JB1.4 181.8,16.19 U$2.BD1
!MA05
  Top 0.813: JB1.5 178.62,16.19 U$2.BE1
!MA06
  Top 0.813: JB1.7 172.28,16.19 U$2.BH1
!MA07
  Top 0.813: JB1.8 169.1,16.19 U$2.BJ1
!MA08
  Top 0.813: JD1.4 48.45,16.19 U$2.DD1
!MA09
  Top 0.813: JD1.5 45.28,16.19 U$2.DE1
!MA10
  Top 0.813: JD1.7 38.93,16.19 U$2.DH1
!MA11
  Top 0.813: JD1.8 35.75,16.19 U$2.DJ1
!MD00
  Top 0.813: JA1.9 235.78,16.19 U$2.AK1
!MD01
  Top 0.813: JA1.10 232.6,16.19 U$2.AL1
!MD02
  Top 0.813: JA1.11 229.43,16.19 U$2.AM1
!MD03  (via drill 0.81)
  Top 0.813: JA1.13 223.07,16.19 U$2.AP1 | v183.71,59.69 181.48,59.69 181.48,60.96 179.58,62.87 177.67,62.87 E11.15 | v224.98,35.56 v183.39,35.56
  Bottom 0.813: JA1.13 224.66,23.5 224.98,23.81 v224.98,35.56 | v183.71,59.69 183.71,50.48 183.39,50.16 v183.39,35.56
!MD04
  Top 0.813: U$2.BK1 165.93,16.19 JB1.9
  Bottom 0.813: E11.9 177.67,47.62 177.99,47.31 177.99,34.29 167.51,23.81 JB1.9
!MD05
  Top 0.813: U$2.BL1 162.75,16.19 JB1.10
  Bottom 0.813: JB1.10 164.34,24.45 166.24,24.45 166.24,46.35 170.05,50.16 E11.7
!MD06  (via drill 0.81)
  Top 0.813: JB1.11 159.57,16.19 U$2.BM1 | v163.07,55.88 170.05,62.87 E11.2
  Bottom 0.813: JB1.11 161.48,18.41 161.48,21.91 161.16,22.23 161.16,23.5 163.07,25.4 v163.07,55.88
!MD07  (via drill 0.81)
  Top 0.813: U$2.BP1 153.22,16.19 JB1.13 | v145.92,44.13 v128.46,44.13 | v145.92,26.99 149.1,26.99 150.37,25.72 v155.13,25.72
  Bottom 0.813: JB1.13 154.81,19.68 155.13,20 155.13,21.91 154.81,22.23 154.81,23.5 155.13,23.81 v155.13,25.72 | v128.46,44.13 128.14,44.45 E8.9 | v145.92,26.99 v145.92,44.13
!MD08  (via drill 0.81)
  Top 0.813: U$2.DK1 32.58,16.19 JD1.9 35.75,19.37 43.69,19.37 43.69,23.81 v42.73,24.77
  Bottom 0.813: v42.73,24.77 42.73,44.77 45.59,47.62 E3.9
!MD09  (via drill 0.81)
  Top 0.813: U$2.DL1 29.4,16.19 JD1.10 | v32.89,38.42 v48.77,38.42 | v50.04,63.5 E3.15
  Bottom 0.813: v50.04,63.5 50.04,60.33 48.77,59.05 v48.77,38.42 | v32.89,38.42 32.89,25.4 30.99,23.5 30.99,22.23 31.31,21.91 31.31,18.41 JD1.10
!MD10  (via drill 0.81)
  Top 0.813: U$2.DM1 26.23,16.19 JD1.11 29.4,19.37 33.21,19.37 v34.16,20.32
  Bottom 0.813: v34.16,20.32 34.16,23.5 34.8,24.13 34.8,46.99 37.97,50.16 E3.7
!MD11  (via drill 0.81)
  Top 0.813: U$2.DP1 19.88,16.19 JD1.13 | v26.86,42.86 v32.26,42.86 | v21.46,24.77 v26.86,24.77 | v32.26,63.5 E3.2
  Bottom 0.813: v32.26,42.86 v32.26,63.5 | v26.86,24.77 v26.86,42.86 | JD1.13 v21.46,24.77
!MD_DIR
  Bottom 0.813: JA2.9 235.78,13.97 U$2.AK2
!MEM_START
  Bottom 0.813: JA2.8 238.95,13.97 U$2.AJ2
!MS_DISABLE
  Top 0.813: JC1.18 73.53,15.88 73.53,13.65 U$2.CV1
!NOT_LAST_TR
  Top 0.813: JC1.11 96.08,16.19 U$2.CM1
!NTS_STALL
  Bottom 0.813: JB2.14 150.05,13.97 U$2.BR2
!OVERFLOW
  Bottom 0.813: JB2.8 169.1,13.97 U$2.BJ2
!ROM_ADDR
  Bottom 0.813: JA2.17 210.38,13.97 U$2.AU2
!RUN
  Bottom 0.813: JB2.17 140.53,13.97 U$2.BU2
!SKIP  (via drill 0.81)
  Top 0.813: U$2.CS1 83.38,16.19 JC1.15 | v84.01,68.9 68.14,68.9 68.14,54.29 70.99,51.44 E5.7
  Bottom 0.813: JC1.15 85.28,18.41 85.28,21.91 84.96,22.23 84.96,67.94 v84.01,68.9
!STOP
  Bottom 0.813: JD2.15 13.52,13.97 U$2.DS2
!TS1
  Bottom 0.813: JC2.9 102.43,13.97 U$2.CK2
!TS2
  Bottom 0.813: JC2.10 99.25,13.97 U$2.CL2
!TS3
  Bottom 0.813: JC2.11 96.08,13.97 U$2.CM2
!TS4
  Bottom 0.813: JC2.13 89.73,13.97 U$2.CP2
!USER_MODE
  Bottom 0.813: JD2.11 26.23,13.97 U$2.DM2
+15V
  Bottom 0.813: JD2.1 57.97,13.97 U$2.DA2
-15V
  Top 0.813: JD2.2 56.39,21.27 124.65,21.27 | 124.65,21.27 JC2.2 | 186.4,21.43 186.25,21.27 124.65,21.27 | 186.4,21.43 187.52,22.54 JB2.2 | JA2.2 257.37,22.54 256.1,21.27 186.56,21.27 186.4,21.43
  Bottom 0.813: U$2.AB2 JA2.2 | JB2.2 U$2.BB2 | JD2.2 U$2.DB2 | JC2.2 U$2.CB2
BTP3
  Bottom 0.813: E6.11 95.12,59.05 93.54,60.64 93.54,74.3 3.1
C0
  Bottom 0.813: E7.9 111.63,53.98 114.49,56.83 114.49,75.56 112.27,77.79 108.14,77.79 108.14,76.83 C0.1
C1
  Bottom 0.813: E7.12 111.63,61.59 113.22,63.18 113.22,74.3 111.95,75.56 C1.1
D0
  Bottom 0.813: E15.15 243.71,64.14 245.3,65.72 245.3,75.56 D0.1
D1
  Bottom 0.813: E15.12 243.71,56.52 248.47,61.28 248.47,75.56 D1.1
D2
  Bottom 0.813: E15.10 243.71,51.44 252.28,60.01 252.28,75.56 D2.1
D3
  Bottom 0.813: E15.7 236.09,51.44 238,53.34 238,71.44 244.35,77.79 256.1,77.79 256.1,76.83 D3.1
D4  (via drill 0.81)
  Top 0.813: v213.55,67.63 227.52,67.63 228.79,66.36 231.33,66.36 231.33,60.64 E15.5
  Bottom 0.813: v213.55,67.63 211.01,70.17 211.01,75.56 204.98,81.6 151.32,81.6 D4.1
D5  (via drill 0.81)
  Top 0.813: v236.73,68.9 v239.27,68.9 | v236.73,80.33 215.14,80.33 214.82,80.64 172.91,80.64 172.59,80.33 154.18,80.33 153.54,79.69 D5.1 | v239.27,63.5 E15.2
  Bottom 0.813: v239.27,68.9 v239.27,63.5 | v236.73,80.33 v236.73,68.9
D6  (via drill 0.81)
  Top 0.813: v27.5,69.22 31.62,73.34 54.48,73.34 58.93,77.79 141.48,77.79 144.65,74.61 152.27,74.61 153.54,75.88 D6.1
  Bottom 0.813: v27.5,69.22 27.5,65.72 29.08,64.14 E2.15
D7  (via drill 0.81)
  Top 0.813: v29.4,34.61 59.56,34.61 60.83,33.34 v94.49,33.34 | v94.49,29.53 99.57,29.53 100.2,30.16 114.49,30.16 115.12,30.8 v141.48,30.8 | v141.48,45.4 146.24,45.4 147.83,46.99 v159.89,46.99 | v27.18,55.88 E2.12 | v160.21,76.2 D7.1
  Bottom 0.813: v27.18,55.88 27.18,48.26 29.4,46.04 v29.4,34.61 | v94.49,33.34 v94.49,29.53 | v141.48,30.8 v141.48,45.4 | v159.89,46.99 159.89,55.56 160.21,55.88 v160.21,76.2
D8
  Bottom 0.813: E2.10 29.08,51.44 30.67,53.02 30.67,75.56 D8.1
D9
  Bottom 0.813: E2.7 21.46,51.44 25.91,55.88 25.91,73.98 29.72,77.79 33.84,77.79 33.84,76.83 D9.1
D10
  Bottom 0.813: E2.5 21.46,56.52 19.88,58.1 19.88,72.07 28.45,80.64 37.65,80.64 37.65,76.83 D10.1
D11  (via drill 0.81)
  Top 0.813: v24.64,68.9 30.35,74.61 39.88,74.61 41.15,75.88 D11.1
  Bottom 0.813: v24.64,68.9 24.64,67.31 21.46,64.14 E2.2
GND
  Top 0.813: U$2.DT2 10.35,16.19 JD1.16 12.57,18.1 13.84,19.37 19.56,19.37 JD2.12 | U$2.AF2 244.98,12.7 244.98,15.88 JA1.6 | U$2.AC1 254.51,12.7 254.51,15.88 JA1.3 | U$2.AT2 213.55,16.19 JA1.16 | U$2.AN2 225.93,12.7 225.93,15.88 JA1.12 | 226.25,24.45 215.14,24.45 JA2.16 211.96,24.45 184.97,24.45 | 226.25,24.45 JA2.12 | 245.3,24.45 JA2.6 | 226.25,24.45 245.3,24.45 | U$2.CF2 111.63,12.38 111.63,15.88 JC1.6 111.95,19.37 96.08,19.37 JC1.12 92.9,16.19 U$2.CN2 | U$2.CC2 121.16,12.38 121.16,15.88 JC1.3 | U$2.BC1 184.66,12.38 184.66,15.88 JB1.3 | U$2.BF2 175.13,13.97 175.13,15.88 JB1.6 | 184.97,24.45 177.04,24.45 JB2.6 173.86,24.45 156.4,24.45 | JB2.3 184.97,24.45 | U$2.BT2 143.7,16.19 JB1.16 | U$2.BN2 156.4,16.19 JB1.12 | 156.4,24.45 143.7,24.45 | 156.4,24.45 JB2.12 | 143.7,24.45 JB2.16 | 121.48,24.45 JC2.3 | 143.7,24.45 121.48,24.45 | U$2.CT2 80.2,16.19 JC1.16 | 80.2,24.45 91,24.45 92.27,23.18 JC2.12 | 80.2,24.45 JC2.16 | U$2.DC2 51.31,13.97 51.31,15.88 JD1.3 | U$2.DF2 42.1,16.19 JD1.6 44.32,18.1 45.59,19.37 48.13,19.37 JD2.3 53.21,24.45 80.2,24.45 | U$2.DN2 22.73,13.97 22.73,15.88 JD1.12 25.27,18.1 28.45,21.27 33.21,21.27 33.53,21.59 34.8,21.59 35.11,21.27 40.51,21.27 JD2.6 | E9.8 136.4,48.26 131.32,53.34 E8.11 | E8.11 E8.12 E8.13 128.14,59.05 | 128.14,59.05 124.65,59.05 124.65,61.28 120.52,65.41 E8.1 | E9.1 136.4,66.04 136.08,66.36 131.32,66.36 129.73,64.77 129.73,59.37 128.14,59.37 128.14,59.05 | E8.8 121.16,48.26 126.24,53.34 E8.11 | E1.1 4.95,65.41 3.37,63.82 3.37,48.9 4.95,48.9 E1.8 | JD2.16 10.03,23.5 10.03,36.83 BYP12.2 | 42.89,55.4 42.42,55.88 E3.5 E3.4 | 44.48,53.82 42.89,55.4 | 44.48,53.82 44.96,53.34 E3.11 48.77,53.34 53.85,48.26 E4.8
  Top 0.813: E3.13 45.59,57.78 43.37,55.56 43.05,55.56 42.89,55.4 | E3.8 38.61,48.26 44.01,53.66 44.32,53.66 44.48,53.82 | E14.8 218.95,48.26 218,49.21 205.3,49.21 203.71,50.8 E13.7 202.44,50.8 200.85,49.21 188.78,49.21 187.2,50.8 E12.7 185.93,50.8 183.39,53.34 E11.11 177.04,53.34 176.56,53.82 | E11.4 E11.5 174.5,55.88 174.97,55.4 | 176.56,53.82 174.97,55.4 | E11.13 177.67,57.78 175.45,55.56 175.13,55.56 174.97,55.4 | E11.8 170.69,48.26 176.09,53.66 176.4,53.66 176.56,53.82 | E5.12 E5.13 | E5.8 71.63,48.26 78.61,55.24 E5.12 | E6.9 E6.10 | E6.9 94.49,53.34 91.95,50.8 E6.7 83.69,54.61 80.52,54.61 79.25,55.88 E5.12 | E7.7 103.38,50.8 101.47,52.7 95.12,52.7 E6.9 | JA2.3 253.24,24.45 245.3,24.45 | JC2.6 113.54,24.45 121.48,24.45
  Bottom 0.813: 10.35,17.78 U$2.DT2 | 10.35,17.78 JD2.16 | U$2.AF2 244.98,13.34 244.98,15.88 JA1.6 246.89,20.95 JA2.6 244.98,23.5 238,30.48 238,45.72 236.09,47.62 E15.8 | U$2.AC1 254.51,13.34 254.51,15.88 JA1.3 256.41,21.27 JA2.3 | U$2.AT2 213.55,16.19 JA1.16 214.82,18.41 214.82,21.27 213.87,22.23 JA2.16 | U$2.AN2 225.93,13.34 225.93,15.88 JA1.12 227.84,20.95 JA2.12 | U$2.CF2 111.63,13.02 111.63,15.88 JC1.6 113.22,18.41 113.22,21.27 112.27,22.23 JC2.6 112.27,23.5 112.27,33.02 105.28,40.01 BYP7.2 105.28,48.9 104.01,50.16 E7.7 | U$2.CC2 121.16,13.02 121.16,15.88 JC1.3 122.75,18.41 122.75,21.27 121.79,22.23 JC2.3 | U$2.BC1 184.66,13.02 184.66,15.88 JB1.3 186.25,18.41 186.25,21.27 185.29,22.23 JB2.3 185.29,23.5 185.29,37.47 187.83,40.01 BYP3.2 187.83,41.27 186.56,42.55 E12.7 | U$2.BF2 175.13,13.97 175.13,15.88 JB1.6 176.72,18.41 176.72,21.27 175.77,22.23 JB2.6 | U$2.BT2 143.7,16.19 JB1.16 144.97,18.41 144.97,21.27 144.02,22.23 JB2.16 | U$2.BN2 156.4,16.19 JB1.12 157.67,18.41 157.67,21.27 156.72,22.23 JB2.12 156.4,38.42 154.81,40.01 BYP5.2 | U$2.CT2 80.2,16.19 JC1.16 81.79,20.95 80.52,22.23 JC2.16 | U$2.CN2 92.9,16.19 JC1.12 94.49,20.95 93.22,22.54 JC2.12 | U$2.DC2 51.31,13.34 51.31,15.88 JD1.3 53.21,21.27 JD2.3 | U$2.DF2 42.1,16.19 JD1.6 43.69,21.27 JD2.6 41.47,23.5 41.47,37.78 39.24,40.01 BYP11.2 39.24,41.27 37.97,42.55 E3.8 | U$2.DN2 22.73,13.02 22.73,15.88 JD1.12 24.64,21.27 JD2.12 22.73,23.5 22.73,46.35 21.46,47.62 E2.8 | JD1.16 10.35,17.78 | SV177.12 78.61,91.44 78.93,91.12 96.08,91.12 | 96.08,91.12 111.31,91.12 112.59,92.71 SV186.12 115.76,92.71 115.76,71.44 120.52,66.67 E8.1
  Bottom 0.813: E8.8 120.52,47.62 121.79,46.35 BYP6.2 | E14.1 219.58,66.67 219.27,66.99 219.27,92.71 SV314.12 | G.1 96.08,76.83 96.08,91.12 | BYP12.2 6.22,41.27 4.95,42.55 E1.8 | BYP10.2 55.75,41.27 54.48,42.55 E4.8 | E3.4 37.97,59.05 39.56,60.64 39.56,63.82 37.97,65.41 E3.1 47.18,75.25 47.18,77.15 43.05,81.28 SV183.12 SV183.11 SV183.10 SV183.9 SV183.8 SV183.7 SV183.6 SV183.5 SV183.4 SV183.3 SV183.2 SV183.1 SV182.12 SV182.11 SV182.10 SV182.9 SV182.8 SV182.7 SV182.6 SV182.5 SV182.4 SV182.3 SV182.2 SV182.1 SV131.10 SV131.9 SV131.8 SV131.7 SV131.6 SV131.5 SV131.4 SV131.3 SV131.2 SV131.1 | E14.8 219.58,47.62 220.22,46.99 220.22,40.64 BYP1.2 | BYP2.2 204.34,41.27 203.07,42.55 E13.7 | E11.8 170.05,47.62 171.32,46.35 BYP4.2 | E11.1 170.05,65.41 168.47,63.82 168.47,60.64 170.05,59.05 E11.4 | BYP9.2 72.26,41.27 70.99,42.55 E5.8 | E5.1 70.99,65.41 77.98,58.42 E5.13 | BYP8.2 88.77,41.27 87.5,42.55 E6.7
  pour Bottom (no thermals): 2.41,187.96 260.22,187.96 260.22,180.34 8.76,180.34 8.76,177.8 6.22,177.8 6.22,180.34 2.41,180.34
  pour Bottom (isolate 0.406, no thermals): 6.22,180.34 8.76,180.34 8.76,92.71 6.22,92.71
  pour Bottom (no thermals): 41.78,180.34 44.32,180.34 44.32,92.71 41.78,92.71
  pour Bottom (no thermals): 77.34,180.34 79.88,180.34 79.88,92.71 77.34,92.71
  pour Bottom (no thermals): 112.9,180.34 115.44,180.34 115.44,92.71 112.9,92.71
  pour Bottom (no thermals): 148.46,180.34 151,180.34 151,92.71 148.46,92.71
  pour Bottom (no thermals): 184.02,180.34 186.56,180.34 186.56,92.71 184.02,92.71
  pour Bottom (no thermals): 219.58,180.34 222.12,180.34 222.12,92.71 219.58,92.71
  pour Bottom (no thermals): 255.14,180.34 257.68,180.34 257.68,92.71 255.14,92.71
  pour Top (isolate 0.406, no thermals): 6.22,92.71 8.76,92.71 8.76,179.07 6.22,179.07
  pour Top (isolate 0.406, no thermals): 41.78,92.71 44.32,92.71 44.32,179.07 41.78,179.07
  pour Top (isolate 0.406, no thermals): 77.34,92.71 79.88,92.71 79.88,179.07 77.34,179.07
  pour Top (isolate 0.406, no thermals): 112.9,92.71 115.44,92.71 115.44,179.07 112.9,179.07
  pour Top (isolate 0.406, no thermals): 148.46,92.71 151,92.71 151,179.07 148.46,179.07
  pour Top (isolate 0.406, no thermals): 184.02,92.71 186.56,92.71 186.56,179.07 184.02,179.07
  pour Top (isolate 0.406, no thermals): 219.58,92.71 222.12,92.71 222.12,179.07 219.58,179.07
  pour Top (isolate 0.406, no thermals): 255.14,92.71 257.68,92.71 257.68,179.07 255.14,179.07
I
  Bottom 0.813: E7.4 104.01,59.05 105.6,60.64 105.6,74.3 104.33,75.56 I.1
I0  (via drill 0.81)
  Top 0.813: v228.79,73.98 228.16,74.61 222.76,74.61 221.49,75.88 I0.1
  Bottom 0.813: v228.79,73.98 228.79,55.56 227.2,53.98 E14.11
I1
  Bottom 0.813: E14.13 227.2,59.05 224.66,61.59 I1.1
I2  (via drill 0.81)
  Top 0.813: v216.72,77.47 217.04,77.79 226.57,77.79 227.84,76.52 I2.1
  Bottom 0.813: v216.72,77.47 216.72,59.37 219.58,56.52 E14.5
I3  (via drill 0.81)
  Top 0.813: v218,79.06 229.11,79.06 231.65,76.52 I3.1
  Bottom 0.813: v218,79.06 218,60.64 219.58,59.05 E14.4
I4
  Bottom 0.813: E9.13 144.65,59.05 141.16,62.55 141.16,74.93 132.91,83.19 122.11,83.19 122.11,76.83 I4.1
I5
  Bottom 0.813: E9.11 144.65,53.98 139.89,58.74 139.89,74.3 132.27,81.92 125.92,81.92 125.92,76.83 I5.1
I6
  Bottom 0.813: E9.4 136.4,58.42 130.05,64.77 130.05,75.88 I6.1
I7
  Bottom 0.813: E9.5 137.03,56.52 138.62,58.1 138.62,70.48 133.54,75.56 I7.1
I8
  Top 0.813: E1.13 12.57,59.05 10.35,61.28 10.35,66.04 8.44,66.04 6.54,67.94 6.54,75.56 I8.1
I9
  Bottom 0.813: E1.11 12.57,53.98 14.16,55.56 14.16,71.75 10.35,75.56 I9.1
I10
  Bottom 0.813: E1.4 4.95,59.05 3.37,60.64 3.37,71.12 8.44,76.2 8.44,76.83 9.4,77.79 13.52,77.79 13.52,76.83 I10.1
I11
  Bottom 0.813: E1.5 4.95,56.52 2.1,59.37 2.1,74.3 6.86,79.06 17.34,79.06 17.34,76.83 I11.1
INHIBIT
  Bottom 0.813: JA2.13 223.07,13.97 U$2.AP2
INITIALIZE
  Top 0.813: JC1.14 86.55,16.19 U$2.CR1
INT_IN_PROG
  Bottom 0.813: JB2.13 153.22,13.97 U$2.BP2
INT_STROBE
  Bottom 0.813: JB2.4 181.8,13.97 U$2.BD2
N$1  (via drill 0.81)
  Top 0.813: v19.56,37.15 60.83,37.15 62.1,35.88 v91.95,35.88 | v90.68,52.39 89.73,53.34 E6.6 | v19.56,55.88 E1.12 | v148.46,40.32 v134.49,40.32 | v134.49,28.26 116.4,28.26 115.76,27.62 101.47,27.62 100.84,26.99 v91.95,26.99 | v148.46,55.88 E9.12 | v221.49,54.61 222.76,54.61 224.03,55.88 E14.12 | v222.44,34.29 182.75,34.29 181.48,35.56 175.45,35.56 175.13,35.88 v148.46,35.88
  Bottom 0.813: v19.56,37.15 v19.56,55.88 | v90.68,52.39 90.68,48.26 91.31,47.62 91.31,43.5 91.95,42.86 v91.95,35.88 v91.95,26.99 | v148.46,55.88 v148.46,40.32 v148.46,35.88 | v134.49,40.32 v134.49,28.26 | v221.49,54.61 221.49,42.23 222.44,41.27 v222.44,34.29
N$18
  Bottom 0.813: E4.15 62.1,64.14 59.88,66.36 59.88,75.56 F0.1
N$19
  Bottom 0.813: E4.14 62.1,61.59 63.69,63.18 63.69,75.56 F1.1
N$20
  Bottom 0.813: E4.13 62.1,59.05 66.87,63.82 66.87,75.56 F2.1
N$21
  Bottom 0.813: E4.12 68.14,55.88 68.14,73.03 70.68,75.56 F3.1
N$22
  Bottom 0.813: E4.11 69.41,53.34 69.41,70.48 74.48,75.56 F4.1
N$23  (via drill 0.81)
  Top 0.813: v58.61,73.98 59.25,74.61 76.71,74.61 77.98,75.88 F5.1
  Bottom 0.813: v58.61,73.98 58.61,65.72 59.25,65.09 59.25,54.29 62.1,51.44 E4.10
N$24
  Bottom 0.813: E4.9 62.74,48.26 71.95,39.05 81.15,39.05 81.15,58.74 82.74,60.33 82.74,75.56 F6.1
N$25  (via drill 0.81)
  Top 0.813: v56.71,72.71 82.42,72.71 85.6,75.88 F7.1
  Bottom 0.813: v56.71,72.71 56.71,53.66 54.48,51.44 E4.7
N$26
  Top 0.813: SV149.1 SV149.3 SV149.5 SV149.7 SV149.9
  Bottom 0.813: SV149.1 SV149.9
N$27
  Top 0.813: SV149.2 SV149.4 SV149.6 SV149.8 SV149.10
  Bottom 0.813: SV149.2 SV149.10
N$28
  Top 0.813: SV150.1 SV150.3 SV150.5 SV150.7 SV150.9
  Bottom 0.813: SV150.1 SV150.9
N$29
  Top 0.813: SV150.2 SV150.4 SV150.6 SV150.8 SV150.10
  Bottom 0.813: SV150.2 SV150.10
N$30
  Top 0.813: SV153.1 SV153.3 SV153.5 SV153.7 SV153.9
  Bottom 0.813: SV153.1 SV153.9
N$31
  Top 0.813: SV153.2 SV153.4 SV153.6 SV153.8 SV153.10
  Bottom 0.813: SV153.2 SV153.10
N$32
  Top 0.813: SV154.1 SV154.3 SV154.5 SV154.7 SV154.9
  Bottom 0.813: SV154.1 SV154.9
N$33
  Top 0.813: SV154.2 SV154.4 SV154.6 SV154.8 SV154.10
  Bottom 0.813: SV154.2 SV154.10
N$34
  Top 0.813: SV155.1 SV155.3 SV155.5 SV155.7 SV155.9
  Bottom 0.813: SV155.1 SV155.9
N$35
  Top 0.813: SV155.2 SV155.4 SV155.6 SV155.8 SV155.10
  Bottom 0.813: SV155.2 SV155.10
N$36
  Top 0.813: SV156.1 SV156.3 SV156.5 SV156.7 SV156.9
  Bottom 0.813: SV156.9 SV156.7 SV156.5 SV156.1
N$37
  Top 0.813: SV156.2 SV156.4 SV156.6 SV156.8 SV156.10
  Bottom 0.813: SV156.2 SV156.4 SV156.6 SV156.8 SV156.10
N$38
  Top 0.813: SV157.1 SV157.3 SV157.5 SV157.7 SV157.9
  Bottom 0.813: SV157.1 SV157.9
N$39
  Top 0.813: SV157.2 SV157.4 SV157.6 SV157.8 SV157.10
  Bottom 0.813: SV157.2 SV157.10
N$40
  Top 0.813: SV158.1 SV158.3 SV158.5 SV158.7 SV158.9
  Bottom 0.813: SV158.1 SV158.9
N$41
  Top 0.813: SV158.2 SV158.4 SV158.6 SV158.8 SV158.10
  Bottom 0.813: SV158.2 SV158.10
N$42  (via drill 0.81)
  Top 0.813: v210.69,42.86 v104.01,42.86 | v104.01,45.72 v82.74,45.72 | v82.74,53.34 E5.11 | v82.42,38.42 v57.97,38.42 | v57.97,55.88 E4.5
  Bottom 0.813: E4.5 E4.4 | v104.01,42.86 v104.01,45.72 | v82.74,53.34 v82.74,45.72 82.42,45.4 v82.42,38.42 | E13.8 v210.69,42.86 | v57.97,38.42 v57.97,55.88
N$43  (via drill 0.81)
  Top 0.813: v233.24,44.45 241.81,44.45 245.3,47.94 245.3,60.33 243.71,60.33 E15.14
  Bottom 0.813: v233.24,44.45 233.24,44.77 E14.10
N$44  (via drill 0.81)
  Top 0.813: v233.24,56.83 236.09,53.98 E15.6
  Bottom 0.813: v233.24,56.83 233.24,66.36 230.69,68.9 230.69,77.79 224.03,77.79 223.07,76.83 223.07,65.09 219.58,61.59 E14.3
N$45  (via drill 0.81)
  Top 0.813: v152.27,32.07 173.23,32.07 173.55,31.75 179.58,31.75 180.85,30.48 208.47,30.48 209.74,31.75 v226.57,31.75 | v226.57,38.1 v241.81,38.1 | v241.81,59.69 238.63,59.69 237.36,60.96 E15.3 | v151,50.8 E9.10
  Bottom 0.813: v151,50.8 151,41.59 152.27,40.32 v152.27,32.07 | v226.57,31.75 v226.57,38.1 | v241.81,38.1 241.81,53.98 241.49,54.29 241.49,57.47 241.81,57.78 v241.81,59.69
N$46
  Top 0.813: JA1.2 258,16.19 U$2.AB1
N$47
  Top 0.813: JA1.1 261.49,16.51 261.49,13.97 U$2.AA1
N$48
  Top 0.813: JB1.2 188.15,16.19 U$2.BB1
N$49
  Top 0.813: JB1.1 191.64,16.51 191.64,13.97 U$2.BA1
N$50
  Top 0.813: JC1.1 128.14,16.51 128.14,13.97 U$2.CA1
N$51
  Bottom 0.813: JB2.15 146.88,13.97 U$2.BS2
N$52
  Top 0.813: JC1.2 124.65,16.19 U$2.CB1
N$53
  Top 0.813: JD1.1 58.29,16.51 58.29,13.97 U$2.DA1
N$54
  Top 0.813: JD1.2 55.43,16.83 55.43,13.65 U$2.DB1
N$55
  Top 0.813: SV159.1 SV159.3 SV159.5 SV159.7 SV159.9
  Bottom 0.813: SV159.1 SV159.9
N$56
  Top 0.813: SV159.2 SV159.4 SV159.6 SV159.8 SV159.10
  Bottom 0.813: SV159.2 SV159.10
N$57
  Top 0.813: SV160.1 SV160.3 SV160.5 SV160.7 SV160.9
  Bottom 0.813: SV160.1 SV160.9
N$58
  Top 0.813: SV160.2 SV160.4 SV160.6 SV160.8 SV160.10
  Bottom 0.813: SV160.2 SV160.10
N$59
  Top 0.813: SV161.1 SV161.3 SV161.5 SV161.7 SV161.9
  Bottom 0.813: SV161.1 SV161.9
N$60
  Top 0.813: SV161.2 SV161.4 SV161.6 SV161.8 SV161.10
  Bottom 0.813: SV161.2 SV161.10
N$61
  Top 0.813: SV162.1 SV162.3 SV162.5 SV162.7 SV162.9
  Bottom 0.813: SV162.1 SV162.9
N$62
  Top 0.813: SV162.2 SV162.4 SV162.6 SV162.8 SV162.10
  Bottom 0.813: SV162.2 SV162.10
N$63
  Top 0.813: SV163.1 SV163.3 SV163.5 SV163.7 SV163.9
  Bottom 0.813: SV163.1 SV163.9
N$64
  Top 0.813: SV163.2 SV163.4 SV163.6 SV163.8 SV163.10
  Bottom 0.813: SV163.2 SV163.10
N$65
  Top 0.813: SV164.1 SV164.3 SV164.5 SV164.7 SV164.9
  Bottom 0.813: SV164.1 SV164.9
N$66
  Top 0.813: SV164.2 SV164.4 SV164.6 SV164.8 SV164.10
  Bottom 0.813: SV164.2 SV164.10
N$67
  Top 0.813: SV165.1 SV165.3 SV165.5 SV165.7 SV165.9
  Bottom 0.813: SV165.1 SV165.9
N$68
  Top 0.813: SV165.2 SV165.4 SV165.6 SV165.8 SV165.10
  Bottom 0.813: SV165.2 SV165.10
N$69
  Top 0.813: SV166.1 SV166.3 SV166.5 SV166.7 SV166.9
  Bottom 0.813: SV166.1 SV166.9
N$70
  Top 0.813: SV166.2 SV166.4 SV166.6 SV166.8 SV166.10
  Bottom 0.813: SV166.2 SV166.10
N$71
  Top 0.813: SV167.1 SV167.3 SV167.5 SV167.7 SV167.9
  Bottom 0.813: SV167.1 SV167.9
N$72
  Top 0.813: SV167.2 SV167.4 SV167.6 SV167.8 SV167.10
  Bottom 0.813: SV167.2 SV167.10
N$73
  Top 0.813: SV168.1 SV168.3 SV168.5 SV168.7 SV168.9
  Bottom 0.813: SV168.1 SV168.5 SV168.7 SV168.9
N$74
  Top 0.813: SV168.2 SV168.4 SV168.6 SV168.8 SV168.10
  Bottom 0.813: SV168.2 SV168.10
N$75
  Top 0.813: SV169.1 SV169.3 SV169.5 SV169.7 SV169.9
  Bottom 0.813: SV169.1 SV169.9
N$76
  Top 0.813: SV169.2 SV169.4 SV169.6 SV169.8 SV169.10
  Bottom 0.813: SV169.2 SV169.10
N$77
  Top 0.813: SV170.1 SV170.3 SV170.5 SV170.7 SV170.9
  Bottom 0.813: SV170.1 SV170.9
N$78
  Top 0.813: SV170.2 SV170.4 SV170.6 SV170.8 SV170.10
  Bottom 0.813: SV170.2 SV170.10
N$79
  Top 0.813: SV171.1 SV171.3 SV171.5 SV171.7 SV171.9
  Bottom 0.813: SV171.1 SV171.9
N$80
  Top 0.813: SV171.2 SV171.4 SV171.6 SV171.8 SV171.10
  Bottom 0.813: SV171.2 SV171.10
N$81
  Top 0.813: SV172.1 SV172.3 SV172.5 SV172.7 SV172.9
  Bottom 0.813: SV172.1 SV172.9
N$82
  Top 0.813: SV172.2 SV172.4 SV172.6 SV172.8 SV172.10
  Bottom 0.813: SV172.2 SV172.10
N$83
  Top 0.813: SV173.1 SV173.3 SV173.5 SV173.7 SV173.9
  Bottom 0.813: SV173.1 SV173.9
N$84
  Top 0.813: SV173.2 SV173.4 SV173.6 SV173.8 SV173.10
  Bottom 0.813: SV173.2 SV173.10
N$85
  Top 0.813: SV174.1 SV174.3 SV174.5 SV174.7 SV174.9
  Bottom 0.813: SV174.1 SV174.9
N$86
  Top 0.813: SV174.2 SV174.4 SV174.6 SV174.8 SV174.10
  Bottom 0.813: SV174.2 SV174.10
N$87
  Top 0.813: SV187.1 SV187.3 SV187.5 SV187.7 SV187.9
  Bottom 0.813: SV187.1 SV187.9
N$88
  Top 0.813: SV187.2 SV187.4 SV187.6 SV187.8 SV187.10
  Bottom 0.813: SV187.2 SV187.10
N$89
  Top 0.813: SV188.1 SV188.3 SV188.5 SV188.7 SV188.9
  Bottom 0.813: SV188.1 SV188.9
N$90
  Top 0.813: SV188.2 SV188.4 SV188.6 SV188.8 SV188.10
  Bottom 0.813: SV188.2 SV188.10
N$91
  Top 0.813: SV189.1 SV189.3 SV189.5 SV189.7 SV189.9
  Bottom 0.813: SV189.1 SV189.5 SV189.7 SV189.9
N$92
  Top 0.813: SV189.2 SV189.4 SV189.6 SV189.8 SV189.10
  Bottom 0.813: SV189.2 SV189.4 SV189.6 SV189.10
N$93
  Top 0.813: SV190.1 SV190.3 SV190.5 SV190.7 SV190.9
  Bottom 0.813: SV190.1 SV190.9
N$94
  Top 0.813: SV190.2 SV190.4 SV190.6 SV190.8 SV190.10
  Bottom 0.813: SV190.2 SV190.10
N$95
  Top 0.813: SV191.1 SV191.3 SV191.5 SV191.7 SV191.9
  Bottom 0.813: SV191.1 SV191.9
N$96
  Top 0.813: SV191.2 SV191.4 SV191.6 SV191.8 SV191.10
  Bottom 0.813: SV191.2 SV191.10
N$97
  Top 0.813: SV192.1 SV192.3 SV192.5 SV192.7 SV192.9
  Bottom 0.813: SV192.1 SV192.9
N$98
  Top 0.813: SV192.2 SV192.4 SV192.6 SV192.8 SV192.10